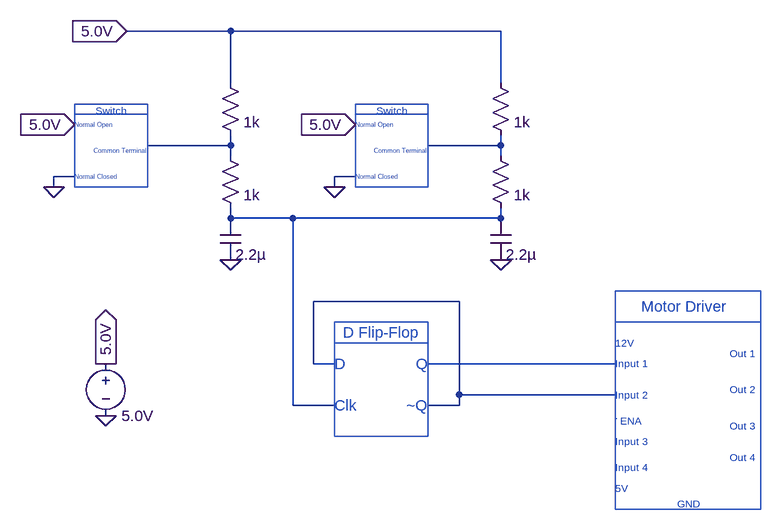
[diagram p0: schematic Direction_Switching_Mechanism.asc]
Direction_Switching_Mechanism.asc, the LTspice schematic file:
Version 4
SHEET 1 1092 2124
WIRE 272 1360 112 1360
WIRE 688 1360 272 1360
WIRE 272 1440 272 1360
WIRE 688 1440 688 1360
WIRE 272 1536 272 1520
WIRE 272 1536 144 1536
WIRE 688 1536 688 1520
WIRE 688 1536 576 1536
WIRE 272 1552 272 1536
WIRE 688 1552 688 1536
WIRE 32 1584 0 1584
WIRE 464 1584 432 1584
WIRE 0 1600 0 1584
WIRE 432 1600 432 1584
WIRE 272 1648 272 1632
WIRE 368 1648 272 1648
WIRE 688 1648 688 1632
WIRE 688 1648 368 1648
WIRE 624 1776 400 1776
WIRE 400 1872 400 1776
WIRE 432 1872 400 1872
WIRE 864 1872 576 1872
WIRE 624 1920 624 1776
WIRE 864 1920 624 1920
WIRE 368 1936 368 1648
WIRE 432 1936 368 1936
WIRE 624 1936 624 1920
WIRE 624 1936 576 1936
FLAG 80 1952 0
FLAG 80 1872 5.0V
IOPIN 80 1872 Out
FLAG 32 1504 5.0V
IOPIN 32 1504 In
FLAG 464 1504 5.0V
IOPIN 464 1504 In
FLAG 0 1600 0
FLAG 432 1600 0
FLAG 688 1712 0
FLAG 272 1712 0
FLAG 112 1360 5.0V
IOPIN 112 1360 In
SYMBOL voltage 80 1856 R0
WINDOW 123 0 0 Left 0
WINDOW 39 0 0 Left 0
WINDOW 0 24 16 Invisible 2
SYMATTR InstName V1
SYMATTR Value 5.0V
SYMBOL res 672 1424 R0
WINDOW 0 36 40 Invisible 2
SYMATTR InstName R1
SYMATTR Value 1k
SYMBOL res 672 1536 R0
WINDOW 0 36 40 Invisible 2
SYMATTR InstName R2
SYMATTR Value 1k
SYMBOL cap 672 1648 R0
WINDOW 0 24 8 Invisible 2
SYMATTR InstName C1
SYMATTR Value 2.2µ
SYMBOL res 256 1424 R0
WINDOW 0 36 40 Invisible 2
SYMATTR InstName R3
SYMATTR Value 1k
SYMBOL res 256 1536 R0
WINDOW 0 36 40 Invisible 2
SYMATTR InstName R4
SYMATTR Value 1k
SYMBOL cap 256 1648 R0
WINDOW 0 24 8 Invisible 2
SYMATTR InstName C2
SYMATTR Value 2.2µ
TEXT 88 1472 Top 1 ;Switch
TEXT 32 1504 Left 0 ;Normal Open
TEXT 32 1584 Left 0 ;Normal Closed
TEXT 144 1544 Right 0 ;Common Terminal
TEXT 520 1472 Top 1 ;Switch
TEXT 464 1504 Left 0 ;Normal Open
TEXT 464 1584 Left 0 ;Normal Closed
TEXT 576 1544 Right 0 ;Common Terminal
TEXT 504 1808 Top 2 ;D Flip-Flop
TEXT 432 1872 Left 2 ;D
TEXT 432 1936 Left 2 ;Clk
TEXT 576 1872 Right 2 ;Q
TEXT 576 1936 Right 2 ;~Q
TEXT 904 1784 Left 2 ;Motor Driver
TEXT 864 1952 Left 1 ;.
TEXT 872 1960 Left 1 ;ENA
TEXT 864 1840 Left 1 ;12V
TEXT 864 2064 Left 1 ;5V
TEXT 960 2088 Left 1 ;GND
TEXT 864 1872 Left 1 ;Input 1
TEXT 864 1920 Left 1 ;Input 2
TEXT 864 1992 Left 1 ;Input 3
TEXT 864 2032 Left 1 ;Input 4
TEXT 1080 1856 Right 1 ;Out 1
TEXT 1080 1912 Right 1 ;Out 2
TEXT 1080 1968 Right 1 ;Out 3
TEXT 1080 2016 Right 1 ;Out 4
RECTANGLE Normal 144 1600 32 1472
RECTANGLE Normal 144 1488 32 1472
RECTANGLE Normal 576 1600 464 1472
RECTANGLE Normal 576 1488 464 1472
RECTANGLE Normal 576 1984 432 1808
RECTANGLE Normal 576 1840 432 1808
RECTANGLE Normal 1088 2096 864 1808
RECTANGLE Normal 1088 1760 864 1808

The netlist it stands for:
* Direction_Switching_Mechanism.asc
V1 5.0V 0 5.0V
R1 5.0V N002 1k
R2 N002 N003 1k
C1 N003 0 2.2µ
R3 5.0V N001 1k
R4 N001 N003 1k
C2 N003 0 2.2µ
* Switch
* Normal Open
* Normal Closed
* Common Terminal
* Switch
* Normal Open
* Normal Closed
* Common Terminal
* D Flip-Flop
* D
* Clk
* Q
* ~Q
* Motor Driver
* .
* ENA
* 12V
* 5V
* GND
* Input 1
* Input 2
* Input 3
* Input 4
* Out 1
* Out 2
* Out 3
* Out 4
.backanno
.end